# Altium schematic sheet Resistor.SchDoc
size A
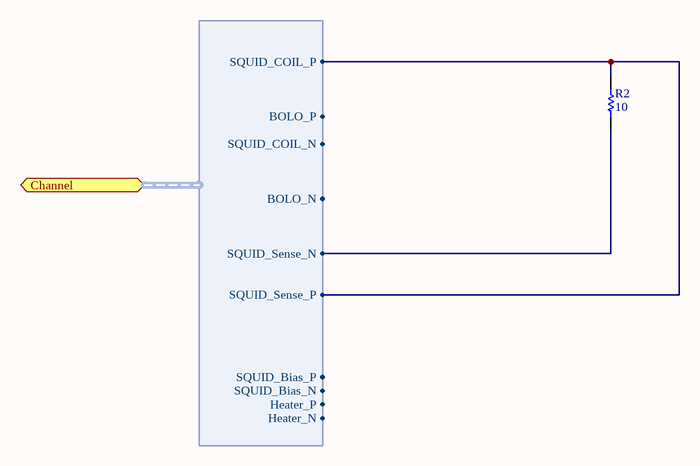
[diagram p0: Resistor.SchDoc]

## Parts
R2  value 10  [0603]  (hidden comment: 10k)

## Ports
Channel (harness SQUID_CH_IN)

## Harnesses
SQUID_CH_IN: SQUID_COIL_P, SQUID_COIL_N, BOLO_P, BOLO_N, SQUID_Sense_P, SQUID_Bias_P, SQUID_Bias_N, Heater_P, SQUID_Sense_N, Heater_N

## Nets
NetR2_1: R2.1 ; port Channel.SQUID_Sense_N
NetR2_2: R2.2 ; port Channel.SQUID_COIL_P, port Channel.SQUID_Sense_P

## Library data of the parts
R2 = RES 0603: Resistor; Manufacturer: Generic; ManufacturerPartNumber 1: e.g CRCW0603 series; Tolerance: 1%; Power: 1/10W; TempCoef: 100ppm/C; Supplier 1: Arrow; Supplier 2: Digi-Key; Supplier Part Number 1: 4070372S9500174N6892; Supplier Part Number 2: 541-0.0GDKR-ND